# EAGLE design SN74ABT273DBR_Breakout (EAGLE 9.6.2)
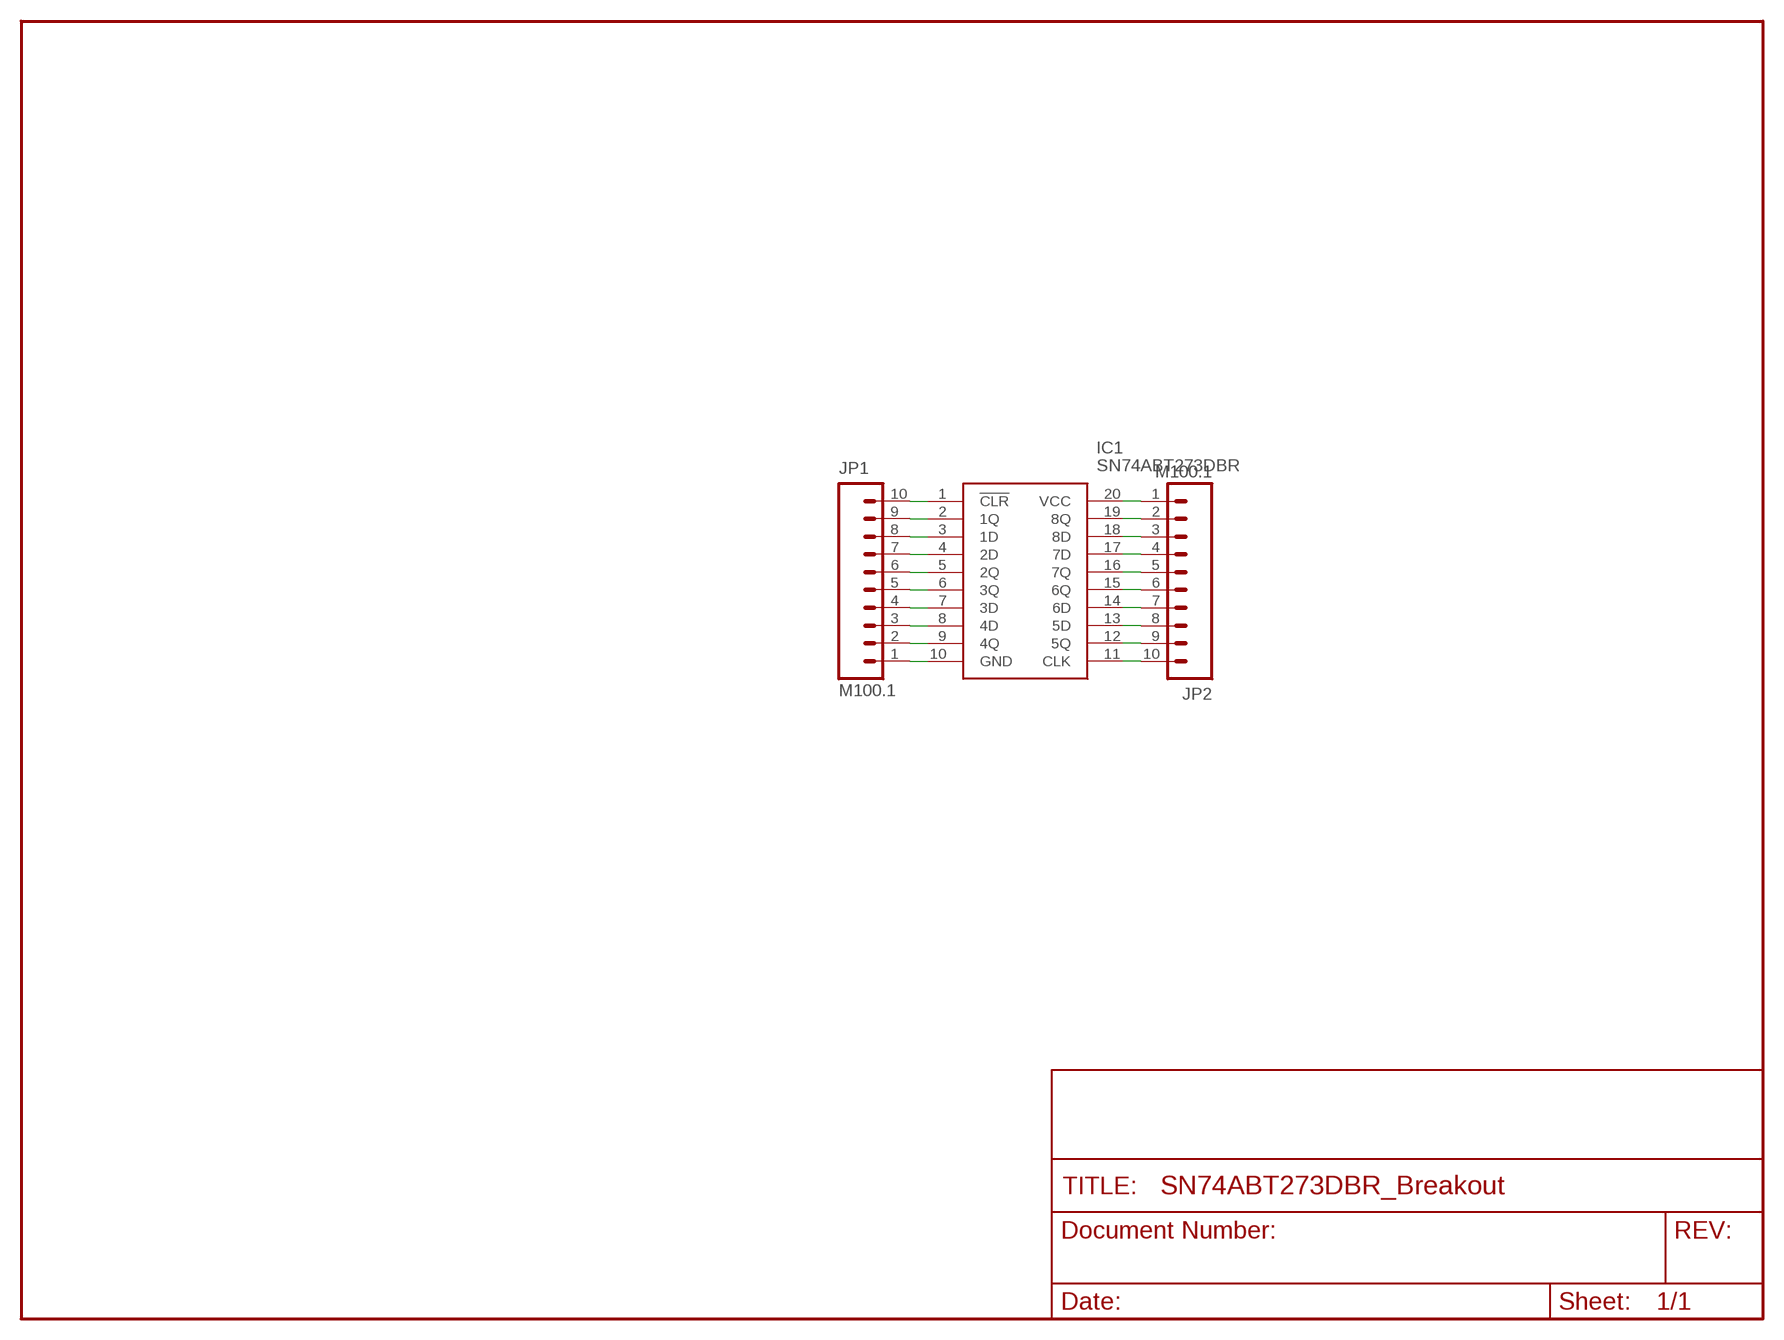
[diagram p0: schematic, sheet 1]

## Parts
IC1  SN74ABT273DBR  [SOP65P780X200-20N]
JP1  M100.1  [1X10]
JP2  M100.1  [1X10]

## Nets
N$1: IC1.10(GND) JP1.1
N$2: IC1.9(4Q) JP1.2
N$3: IC1.8(4D) JP1.3
N$4: IC1.7(3D) JP1.4
N$5: IC1.6(3Q) JP1.5
N$6: IC1.5(2Q) JP1.6
N$7: IC1.4(2D) JP1.7
N$8: IC1.3(1D) JP1.8
N$9: IC1.2(1Q) JP1.9
N$10: IC1.1(!CLR) JP1.10
N$11: IC1.20(VCC) JP2.1
N$12: IC1.19(8Q) JP2.2
N$13: IC1.18(8D) JP2.3
N$14: IC1.17(7D) JP2.4
N$15: IC1.16(7Q) JP2.5
N$16: IC1.15(6Q) JP2.6
N$17: IC1.14(6D) JP2.7
N$18: IC1.13(5D) JP2.8
N$19: IC1.12(5Q) JP2.9
N$20: IC1.11(CLK) JP2.10

## Library data of the parts
IC1 = SN74ABT273DBR:SN74ABT273DBR: Octal Edge-Triggered D-Type Flip-Flops With Clear Source: Datasheet <http://www.ti.com/lit/gpn/sn74abt273>; DESCRIPTION: Octal Edge-Triggered D-Type Flip-Flops With Clear; HEIGHT: 2mm; MANUFACTURER_NAME: Texas Instruments; MANUFACTURER_PART_NUMBER: SN74ABT273DBR; MOUSER_PART_NUMBER: 595-SN74ABT273DBR; MOUSER_PRICE-STOCK: https://www.mouser.co.uk/ProductDetail/Texas-Instruments/SN74ABT273DBR?qs=X1HXWTtiZ0RWq%2Fv0JNOEpw%3D%3D
JP1 JP2 = SparkFun:M10: Header 10 Standard 10-pin 0.1" header. Use with straight break away headers (SKU : PRT-00116), right angle break away headers (PRT-00553), swiss pins (PRT-00743), machine pins (PRT-00117), and female headers (PRT-00115).

## Board
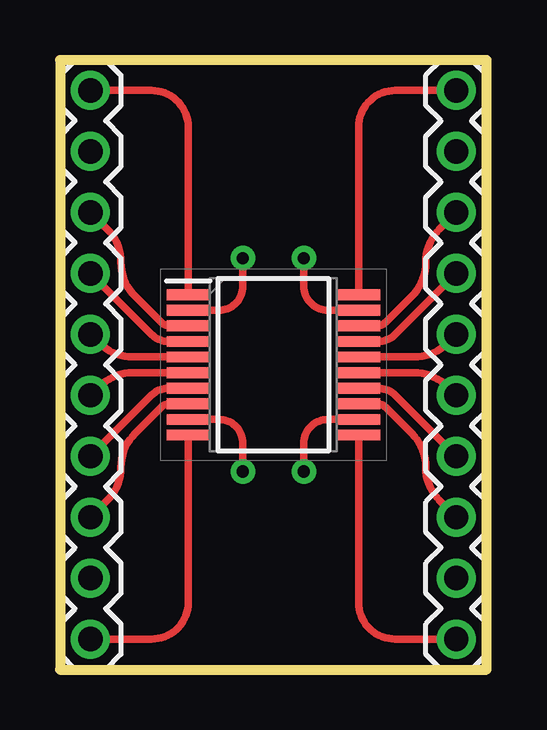
[diagram p1: board, top side]
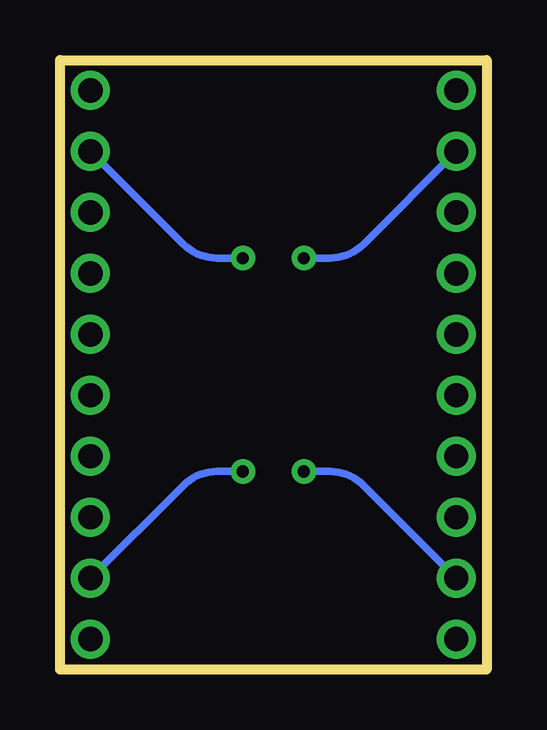
[diagram p2: board, bottom side, seen from below]

Size 17.78 x 25.4 mm. Coordinates in mm from the lower left corner, seen from the top.
Outline: 0,0 17.78,0 17.78,25.4 0,25.4 0,0
Copper layers (1*16): Top 0.035mm / dielectric 1.5mm / Bottom 0.035mm
Design rules "SparkFun": minimum track width 8mil, minimum drill 20mil, track to track 8mil, track to pad 8mil, pad to pad 8mil, via to via 8mil, smd to smd 8mil, copper to edge 10mil, drill to drill 8mil, minimum pad ring 12mil, minimum via ring 10mil, stop-mask expansion 4mil, vias tented up to drill 25mil, thermal gap 10mil

### Footprints (pad centres in the part's own frame; a part is rotated, then mirrored left to right if it is on the bottom)
SOP65P780X200-20N = smd 1.8 x 0.45: 1 -3.55,2.925; 2 -3.55,2.275; 3 -3.55,1.625; 4 -3.55,0.975; 5 -3.55,0.325; 6 -3.55,-0.325; 7 -3.55,-0.975; 8 -3.55,-1.625; 9 -3.55,-2.275; 10 -3.55,-2.925; 11 3.55,-2.925; 12 3.55,-2.275; 13 3.55,-1.625; 14 3.55,-0.975; 15 3.55,-0.325; 16 3.55,0.325; 17 3.55,0.975; 18 3.55,1.625; 19 3.55,2.275; 20 3.55,2.925
1X10 = drill 1.016: 1 0,0; 2 2.54,0; 3 5.08,0; 4 7.62,0; 5 10.16,0; 6 12.7,0; 7 15.24,0; 8 17.78,0; 9 20.32,0; 10 22.86,0

### Placement (x,y rotation side)
IC1  8.89,12.7 0 top
JP1  1.27,1.27 90 top
JP2  16.51,24.13 270 top

### Tracks (layer width: path | path; a pad name or v marks a point on that pad's centre or on a via)
N$1
  Top 0.305: JP1.1 3.81,1.27 arc90 5.34,2.8 IC1.10
N$2  (via drill 0.51)
  Top 0.305: v7.62,8.26 7.62,9.43 arc90 6.62,10.43 IC1.9
  Bottom 0.305: v7.62,8.26 6.54,8.26 arc45 5.13,7.67 JP1.2
N$3
  Top 0.305: IC1.8 4.57,11.07 arc45 4.22,10.93 3.13,9.84 arc45 2.54,8.42 arc-45 1.97,7.05 JP1.3
N$4
  Top 0.305: IC1.7 4.52,11.72 arc45 3.81,11.43 JP1.4
N$5
  Top 0.305: IC1.6 3.04,12.38 arc45 1.63,11.79 JP1.5
N$6
  Top 0.305: IC1.5 3.04,13.03 arc-45 1.63,13.61 JP1.6
N$7
  Top 0.305: IC1.4 4.52,13.68 arc-45 3.81,13.97 JP1.7
N$8
  Top 0.305: IC1.3 4.57,14.32 arc-45 4.22,14.47 3.13,15.56 arc-45 2.54,16.98 arc45 1.97,18.35 JP1.8
N$9  (via drill 0.51)
  Top 0.305: IC1.2 6.62,14.97 arc90 7.62,15.97 v7.62,17.14
  Bottom 0.305: v7.62,17.14 6.54,17.14 arc-45 5.13,17.73 JP1.9
N$10
  Top 0.305: IC1.1 5.34,22.6 arc90 3.81,24.13 JP1.10
N$11
  Top 0.305: IC1.20 12.44,22.6 arc-90 13.97,24.13 JP2.1
N$12  (via drill 0.51)
  Top 0.305: v10.16,17.14 10.16,15.97 arc90 11.16,14.97 IC1.19
  Bottom 0.305: v10.16,17.14 11.24,17.14 arc45 12.65,17.73 JP2.2
N$13
  Top 0.305: IC1.18 13.21,14.32 arc45 13.56,14.47 14.65,15.56 arc45 15.24,16.98 arc-45 15.81,18.35 JP2.3
N$14
  Top 0.305: JP2.4 13.97,13.97 arc-45 13.26,13.68 IC1.17
N$15
  Top 0.305: IC1.16 14.74,13.03 arc45 16.15,13.61 JP2.5
N$16
  Top 0.305: IC1.15 14.74,12.38 arc-45 16.15,11.79 JP2.6
N$17
  Top 0.305: IC1.14 13.26,11.72 arc-45 13.97,11.43 JP2.7
N$18
  Top 0.305: IC1.13 13.21,11.07 arc-45 13.56,10.93 14.65,9.84 arc-45 15.24,8.42 arc45 15.81,7.05 JP2.8
N$19  (via drill 0.51)
  Top 0.305: v10.16,8.26 10.16,9.43 arc-90 11.16,10.43 IC1.12
  Bottom 0.305: v10.16,8.26 11.24,8.26 arc-45 12.65,7.67 JP2.9
N$20
  Top 0.305: IC1.11 12.44,2.8 arc90 13.97,1.27 JP2.10